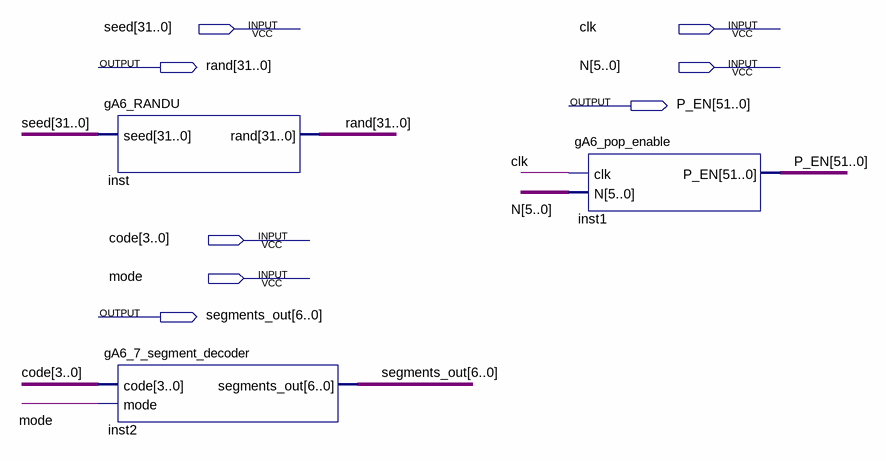
[diagram p0: schematic sheet]
// Quartus schematic gA6_lab2.bdf as structural Verilog: 3 symbols, 8 pins
module gA6_lab2 (
  input  [31:0] seed,
  input  clk,
  input  [5:0] N,
  input  [3:0] code,
  input  mode,
  output [31:0] \rand ,
  output [51:0] P_EN,
  output [6:0] segments_out
);

  gA6_RANDU inst (.seed(seed), .\rand (\rand ));
  gA6_7_segment_decoder inst2 (.code(code), .mode(mode), .segments_out(segments_out));
  gA6_pop_enable inst1 (.clk(clk), .N(N), .P_EN(P_EN));
endmodule
